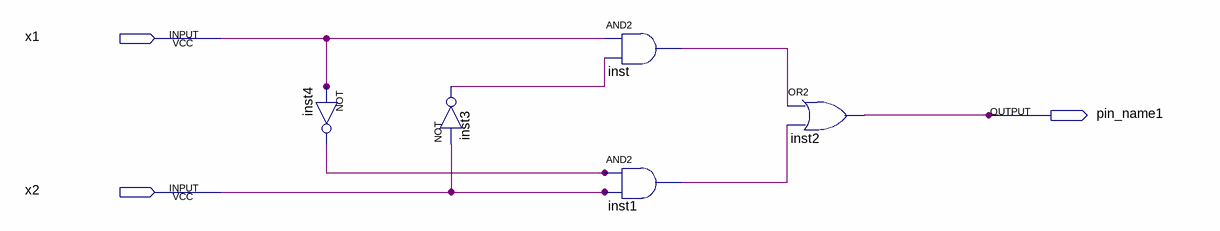
[diagram p0: schematic sheet]
// Quartus schematic light.bdf as structural Verilog: 5 symbols, 3 pins
module light (
  input  x1,
  input  x2,
  output pin_name1
);

  wire inst1_out, inst3_out, inst4_out, inst_out;

  not inst4 (inst4_out, x1);
  not inst3 (inst3_out, x2);
  and inst (inst_out, x1, inst3_out);
  and inst1 (inst1_out, inst4_out, x2);
  or inst2 (pin_name1, inst_out, inst1_out);
endmodule
